# EAGLE design Magnetophon (EAGLE 7.4.0)
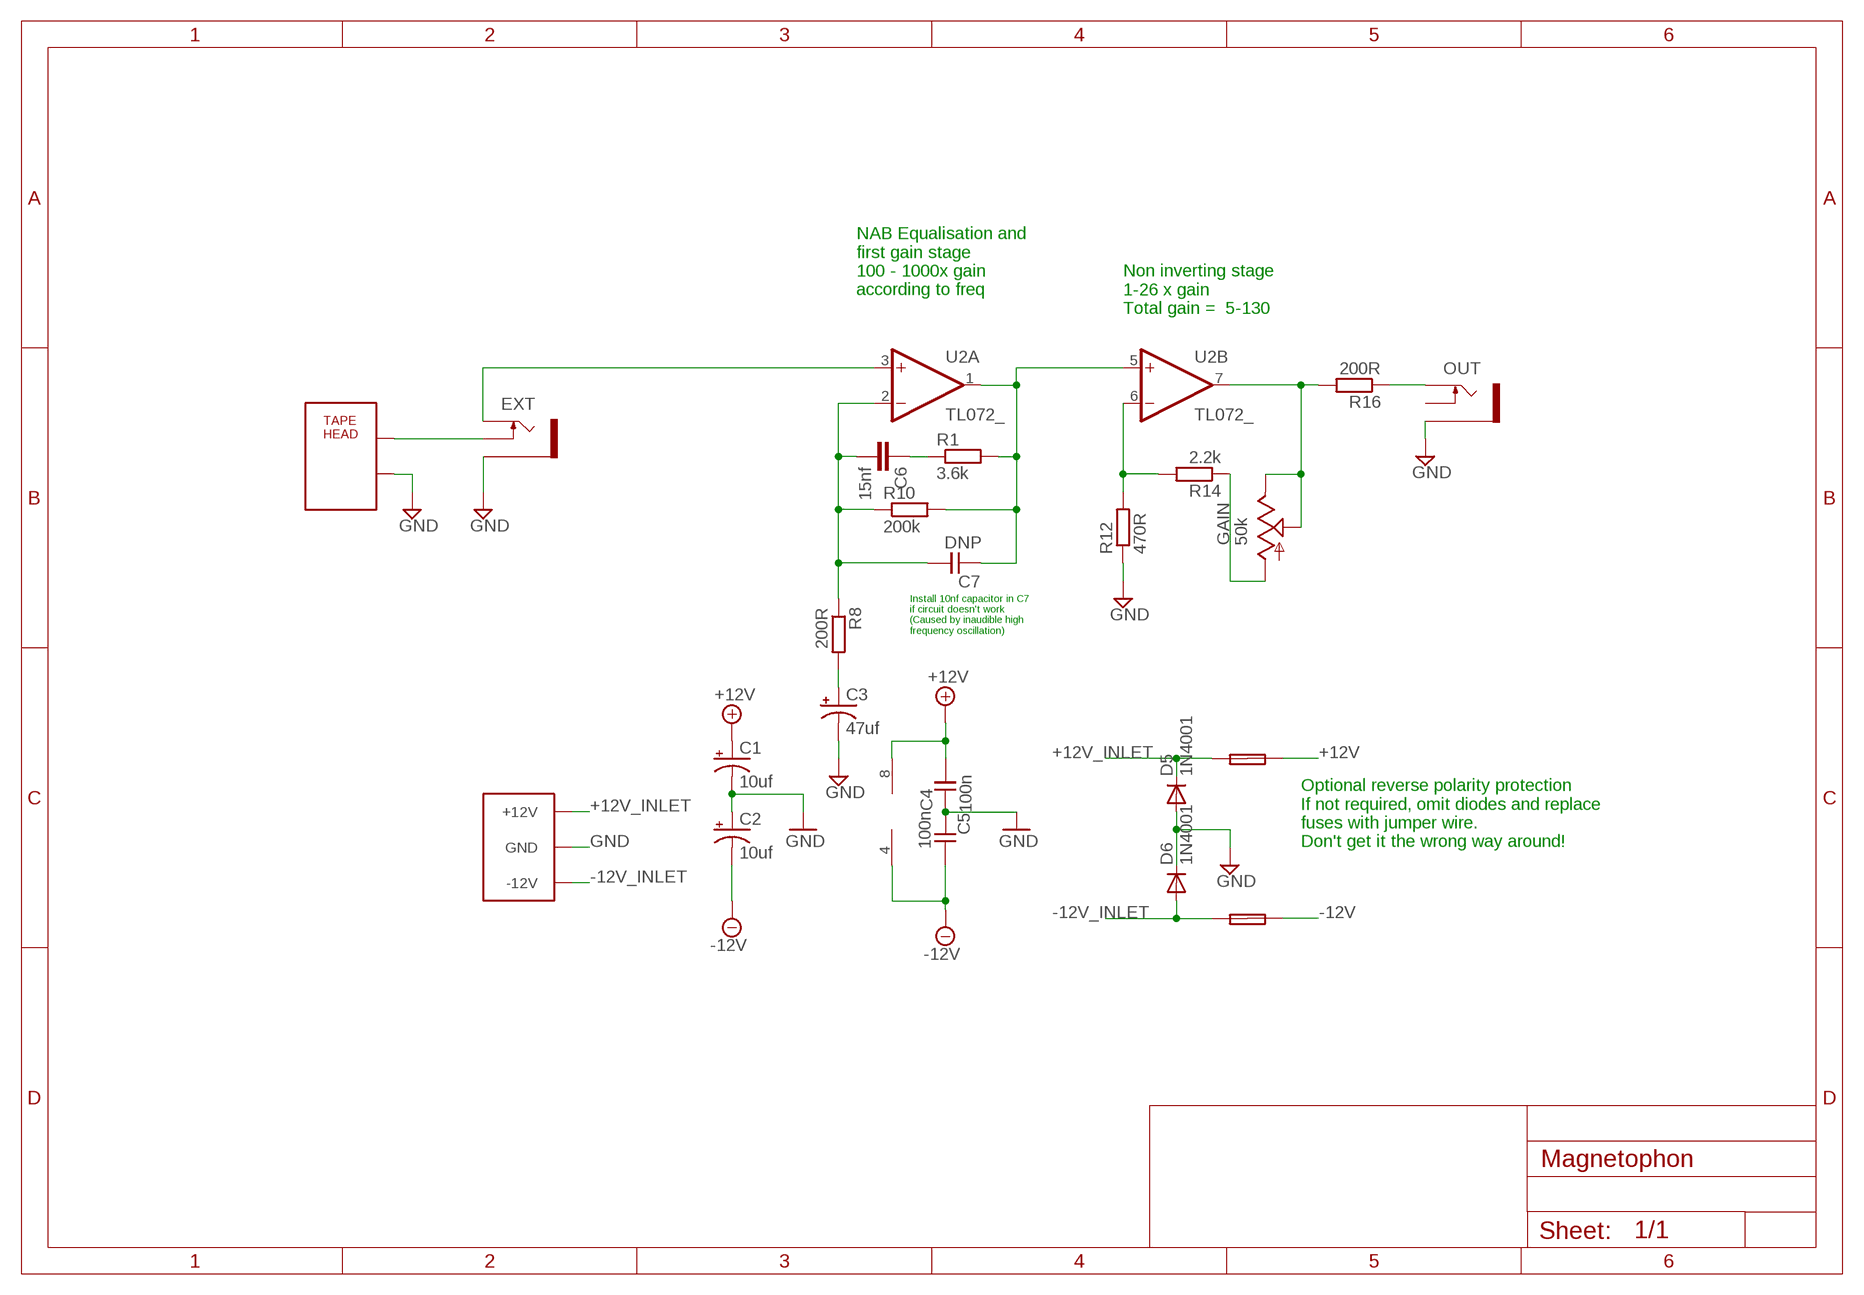
[diagram p0: schematic, sheet 1]

## Parts
1  FUSE  PTC_FUSEPOLY_FUSE  [C050H075X075]
C1  10uf  CAP_POLPTH2  [CPOL-RADIAL-10UF-25V]
C2  10uf  CAP_POLPTH2  [CPOL-RADIAL-10UF-25V]
C3  47uf  CAP_POLPTH2  [CPOL-RADIAL-10UF-25V]
C4  100n  C-EU050-024X044  [C050-024X044]
C5  100n  C-EU050-024X044  [C050-024X044]
C6  15nf  C-EU050-030X075  [C050-030X075]
C7  DNP  C-EU050-024X044  [C050-024X044]
D5  1N4001  1N4004  [DO41-10]
D6  1N4001  1N4004  [DO41-10]
EXT  THONKICONNNEW  [WQP-PJ301M-12_JACK]
FUSE  FUSE  PTC_FUSEPOLY_FUSE  [C050H075X075]
GAIN  50k  ALPHA-9MMF2A  [EVUF]
OUT  THONKICONNNEW  [WQP-PJ301M-12_JACK]
R1  3.6k  RESISTOR7MM  [7MM_RESISTOR]
R8  200R  RESISTOR7MM  [7MM_RESISTOR]
R10  200k  RESISTOR7MM  [7MM_RESISTOR]
R12  470R  RESISTOR7MM  [7MM_RESISTOR]
R14  2.2k  RESISTOR7MM  [7MM_RESISTOR]
R16  200R  RESISTOR7MM  [7MM_RESISTOR]
U2  TL072_  [DIL08]
U$1  MONO_CASSETTE_HEAD  [MONO_CASSETTE_HEAD]
U$2  EURO_POWER_LOCK  [EURO_PWR_HEADER_LOCK]

## Nets
+12V [power]: 1.2 C1.1(+) C4.1 U2.8(P:V+)
+12V_INLET: 1.1 D5.C U$2.POS1(+12V) U$2.POS2(+12V)
-12V [power]: C2.2(-) C5.1 FUSE.2 U2.4(P:V-)
-12V_INLET: D6.A FUSE.1 U$2.NEG1(-12V) U$2.NEG2(-12V)
FROMHEAD: EXT.P$2_SWITCH(SWITCH) U$1.P$1
GND [ground]: C1.2(-) C2.1(+) C3.2(-) C4.2 C5.2 D5.A D6.C EXT.P$3_SLEEVE(SLEEVE) OUT.P$3_SLEEVE(SLEEVE) R12.1 U$1.P$2 U$2.GND1(GND) U$2.GND2(GND) U$2.GND3(GND) U$2.GND4(GND) U$2.GND5(GND) U$2.GND6(GND)
N$3: C6.2 C7.1 R8.1 R10.1 U2.2(A:-IN)
N$4: C7.2 R1.2 R10.2 U2.1(A:OUT) U2.5(B:+IN)
N$5: GAIN.1(A) R14.1
N$6: R12.2 R14.2 U2.6(B:-IN)
N$7: C3.1(+) R8.2
N$8: GAIN.2(S) GAIN.3(E) R16.2 U2.7(B:OUT)
N$9: C6.1 R1.1
N$10: OUT.P$1_TIP(TIP) R16.1
TOAMP: EXT.P$1_TIP(TIP) U2.3(A:+IN)
Unconnected: OUT.P$2_SWITCH(SWITCH)

## Notes on the sheet
- NAB Equalisation and 
  first gain stage
  100 - 1000x gain 
  according to freq
- Non inverting stage
  1-26 x gain
  Total gain =  5-130
- Install 10nf capacitor in C7 
  if circuit doesn't work
  (Caused by inaudible high 
  frequency oscillation)
- Optional reverse polarity protection
  If not required, omit diodes and replace
  fuses with jumper wire. 
  Don't get it the wrong way around!

## Library data of the parts
1 FUSE = TomW:PTC_FUSE
C1-C3 = SparkFun-Passives:CAP_POL: Capacitor Polarized These are standard SMD and PTH capacitors. Normally 10uF, 47uF, and 100uF in electrolytic and tantalum varieties. Always verify the external diameter of the through hole cap, it varies with capacity, voltage, and manufacturer. The EIA devices should be standard.
C4 C5 C7 = TomW:C-EU: CAPACITOR, European symbol
C6 = rcl:C-EU: CAPACITOR, European symbol
D5 D6 = diode:1N4004: DIODE general purpose rectifier, 1 A
EXT OUT = MusicThingModular:THONKICONN: 3.5mm socket for Eurorack modular synths
GAIN = TomW:ALPHA-9MM: 9 mm Square Rotary Potentiometers Source: Panasonic
R1 R8 R10 R12 R14 R16 = MusicThingModular:RESISTOR: Standard resistor, various versions
U2 = MusicThingModular:TL072: Generic Dual Op Amp
U$1 = MusicThingModular:MONO_CASSETTE_HEAD
U$2 = MusicThingModular:EURO_POWER_LOCK

## Net classes
0 default: width 0.305 mm
1 power: width 0.406 mm
2 ground: width 0.406 mm

## Board
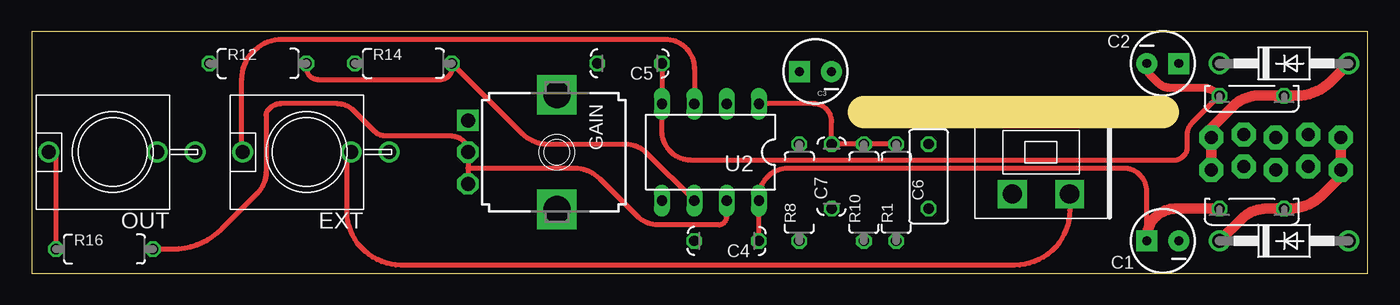
[diagram p1: board, top side]
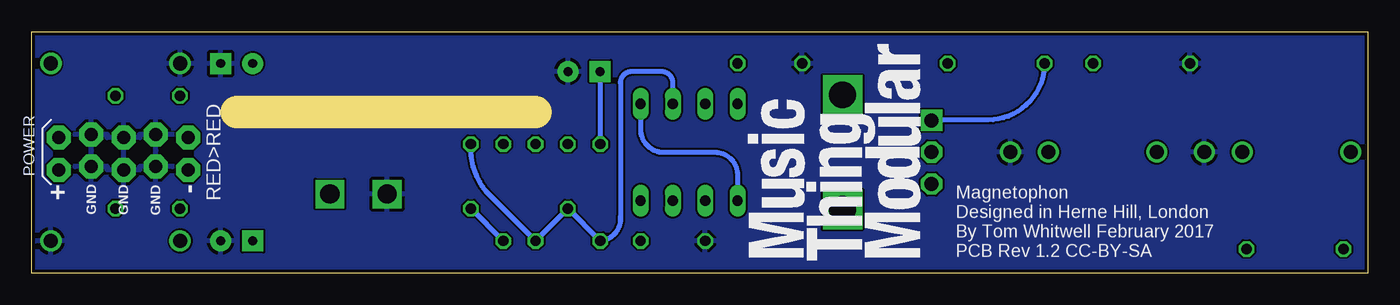
[diagram p2: board, bottom side, seen from below]

Size 105 x 19 mm. Coordinates in mm from the lower left corner, seen from the top.
Outline: 0,19 0,0 105,0 105,19 0,19
Copper layers (1*2*15*16): Top 0.035mm / dielectric 0.2mm / Route2 0.0175mm / dielectric 1.1mm / Route15 0.0175mm / dielectric 0.2mm / Bottom 0.035mm
Design rules "SeeedStudio_DRU_no_angle_20130527": minimum track width 6mil, minimum drill 12mil, track to track 6mil, track to pad 6mil, pad to pad 6mil, via to via 6mil, smd to smd 0mil, copper to edge 10mil, drill to drill 10mil, minimum pad ring 6mil, minimum via ring 6mil, stop-mask expansion 2mil, vias tented up to drill 25mil, thermal gap 10mil
Milling: 1 lines

### Footprints (pad centres in the part's own frame; a part is rotated, then mirrored left to right if it is on the bottom)
C050H075X075 = drill 0.813 octagon: 1 -2.54,0; 2 2.54,0
CPOL-RADIAL-10UF-25V = drill 0.7 pad 1.651 square: 1 1.27,0 | drill 0.7 pad 1.651: 2 -1.27,0
C050-024X044 = drill 0.813 octagon: 1 -2.54,0; 2 2.54,0
C050-030X075 = drill 0.813 octagon: 1 -2.54,0; 2 2.54,0
DO41-10 = drill 1.118: A 5.08,0; C -5.08,0
WQP-PJ301M-12_JACK = drill 1.1: P$1_TIP 0,5; P$2_SWITCH 0,-3.5; P$3_SLEEVE 0,-6.5
EVUF = drill 1.1 pad 1.676 square: 1 -2.5,-7 | drill 1.1 pad 1.676 octagon: 2 0,-7; 3 2.5,-7 | drill 2.1 pad 2.8 square: M1 4.5,0; M2 -4.5,0
7MM_RESISTOR = drill 0.813 octagon: 1 -3.81,0; 2 3.81,0
DIL08 = drill 0.813 pad 1.27 long: 1 -3.81,-3.81; 2 -1.27,-3.81; 3 1.27,-3.81; 4 3.81,-3.81; 5 3.81,3.81; 6 1.27,3.81; 7 -1.27,3.81; 8 -3.81,3.81
MONO_CASSETTE_HEAD = drill 1.5 square: P$1 -2.25,3.3; P$2 2.25,3.3
EURO_PWR_HEADER_LOCK = drill 1.016 pad 1.88 octagon: GND1 -2.54,1.143; GND2 -2.54,-1.397; GND3 0,1.397; GND4 0,-1.143; GND5 2.54,1.143; GND6 2.54,-1.397; NEG1 -5.08,1.397; NEG2 -5.08,-1.143; POS1 5.08,1.397; POS2 5.08,-1.143

### Placement (x,y rotation side)
1  95.89,5.08 180 top
C1  88.9,2.54 180 top
C2  88.9,16.51 0 top
C3  61.59,15.88 180 top
C4  54.61,2.54 180 top
C5  46.99,16.51 180 top
C6  70.48,7.62 90 top
C7  62.87,7.62 90 top
D5  98.42,2.54 0 top
D6  98.42,16.51 0 top
EXT  21.59,9.53 90 top
FUSE  95.89,13.97 180 top
GAIN  41.27,9.53 270 top
OUT  6.35,9.53 90 top
R1  67.94,6.35 90 top
R8  60.33,6.35 90 top
R10  65.41,6.35 90 top
R12  17.78,16.51 0 top
R14  29.21,16.51 0 top
R16  5.71,1.91 0 top
U2  53.34,9.53 180 top
U$1  79.32,9.53 180 top
U$2  97.79,9.53 180 bottom

### Tracks (layer width: path | path; a pad name or v marks a point on that pad's centre or on a via)
+12V
  Top 0.406: C1.1 87.63,2.79 87.63,6.46 arc90 85.83,8.26 59.44,8.26 arc90 57.15,5.96 U2.8 C4.1
  Top 0.813: 1.2 89.92,5.08 arc90 87.63,2.79
+12V_INLET
  Top 0.406: U$2.POS1 102.87,7.62 | 98.84,5.08 1.1
  Top 0.813: U$2.POS2 U$2.POS1 | 102.87,7.62 101.38,6.13 arc-45 98.84,5.08 | 1.1 97,5.08 arc45 95.1,4.29 D5.C
-12V
  Top 0.406: C5.1 U2.4 49.53,11.18 arc90 51.82,8.89 89.8,8.89 arc45 90.43,9.15 90.62,9.34 arc45 90.81,9.79 90.81,10.84 arc-45 91.22,11.85 FUSE.2
  Top 0.61: C2.2 87.63,16.25 arc45 87.89,15.61 88.53,14.98 arc45 89.43,14.61 91.97,14.61 arc-45 93.24,14.08 FUSE.2
-12V_INLET
  Top 0.813: U$2.NEG1 U$2.NEG2 92.71,11.43 94.42,13.14 arc-45 96.43,13.97 FUSE.1 99.43,13.97 arc45 102.05,15.05 D6.A
FROMHEAD
  Top 0.406: U$1.P$1 81.57,6.33 81.58,4.97 arc-90 77.26,0.64 29.02,0.64 arc-90 24.77,4.89 24.77,8.89 EXT.P$2_SWITCH
GND
  pour Bottom: 0,21.91 -1.27,-1.27 106.16,-0.64 106.16,21.27
N$3
  Bottom 0.406: C6.2 70.48,9.74 arc-45 68.99,6.12 R10.1 C7.1 | C7.1 R8.1 arc-90 58.74,4.45 58.74,14.98 arc90 57.84,15.88 55.51,15.88 arc90 54.61,14.98 U2.2 | 62.49,5.08 C7.1
N$4
  Top 0.406: R1.2 R10.2 C7.2 62.87,11.91 arc90 61.45,13.34 U2.1
  Bottom 0.406: U2.1 57.15,11.32 arc-90 55.35,9.53 51.33,9.53 arc90 49.53,7.73 U2.5
N$5
  Bottom 0.406: R14.1 arc90 29.84,12.06 34.23,12.06 GAIN.1
N$6
  Top 0.406: 33,16.49 R14.2 | R14.2 38.54,10.99 arc45 40.55,10.16 46.68,10.16 arc-45 48.3,9.49 U2.6 | R12.2 21.59,16.14 arc90 22.49,15.24 32.12,15.24 arc90 33.02,16.14 R14.2
N$7
  Bottom 0.406: C3.1 R8.2
N$8
  Top 0.406: R16.2 11.07,1.91 arc45 14.94,3.5 17.74,6.31 arc45 18.41,7.93 18.41,12.44 arc-45 18.6,12.89 18.68,12.96 arc-45 19.58,13.34 24.02,13.34 arc-45 25.29,12.81 26.93,11.17 arc45 27.83,10.79 33.01,10.79 arc-90 GAIN.2 34.27,8.26 | 34.27,8.26 GAIN.3 | U2.7 54.61,4.45 arc-90 53.98,3.81 49.21,3.81 arc-45 47.59,4.48 44.65,7.42 arc45 42.64,8.26 34.27,8.26
N$9
  Bottom 0.406: R1.1 C6.1
N$10
  Top 0.406: R16.1 1.91,8.97 arc90 OUT.P$1_TIP
TOAMP
  Top 0.406: EXT.P$1_TIP 16.51,9.53 16.51,15.24 arc-90 19.68,18.41 49.78,18.41 arc-90 52.07,16.12 U2.3

### Text on the board
Dimension: Cut out
bPlace: Magnetophon / Designed in Herne Hill, London / By Tom Whitwell February 2017 / PCB Rev 1.2 CC-BY-SA
bStop: Inspired by: Laurie Anderson, Nam June Paik, / Brian Eno, Stockhausen, Yoko Ono, Steve Reich, / Sender & Subotnik, Terry Riley, Halim El-Dabh, / John Cage, Hugh Le Caine, Delia Derbyshire